# EasyEDA schematic 1-Schematic_ESC36V_2.0.json

## Sheets
1 Procesor: TITLE: Procesor; REV: 1.1; Date: 2019-11-12; Sheet: 2/6; Drawn By: Szymon Hałucha; Company: Robonomik
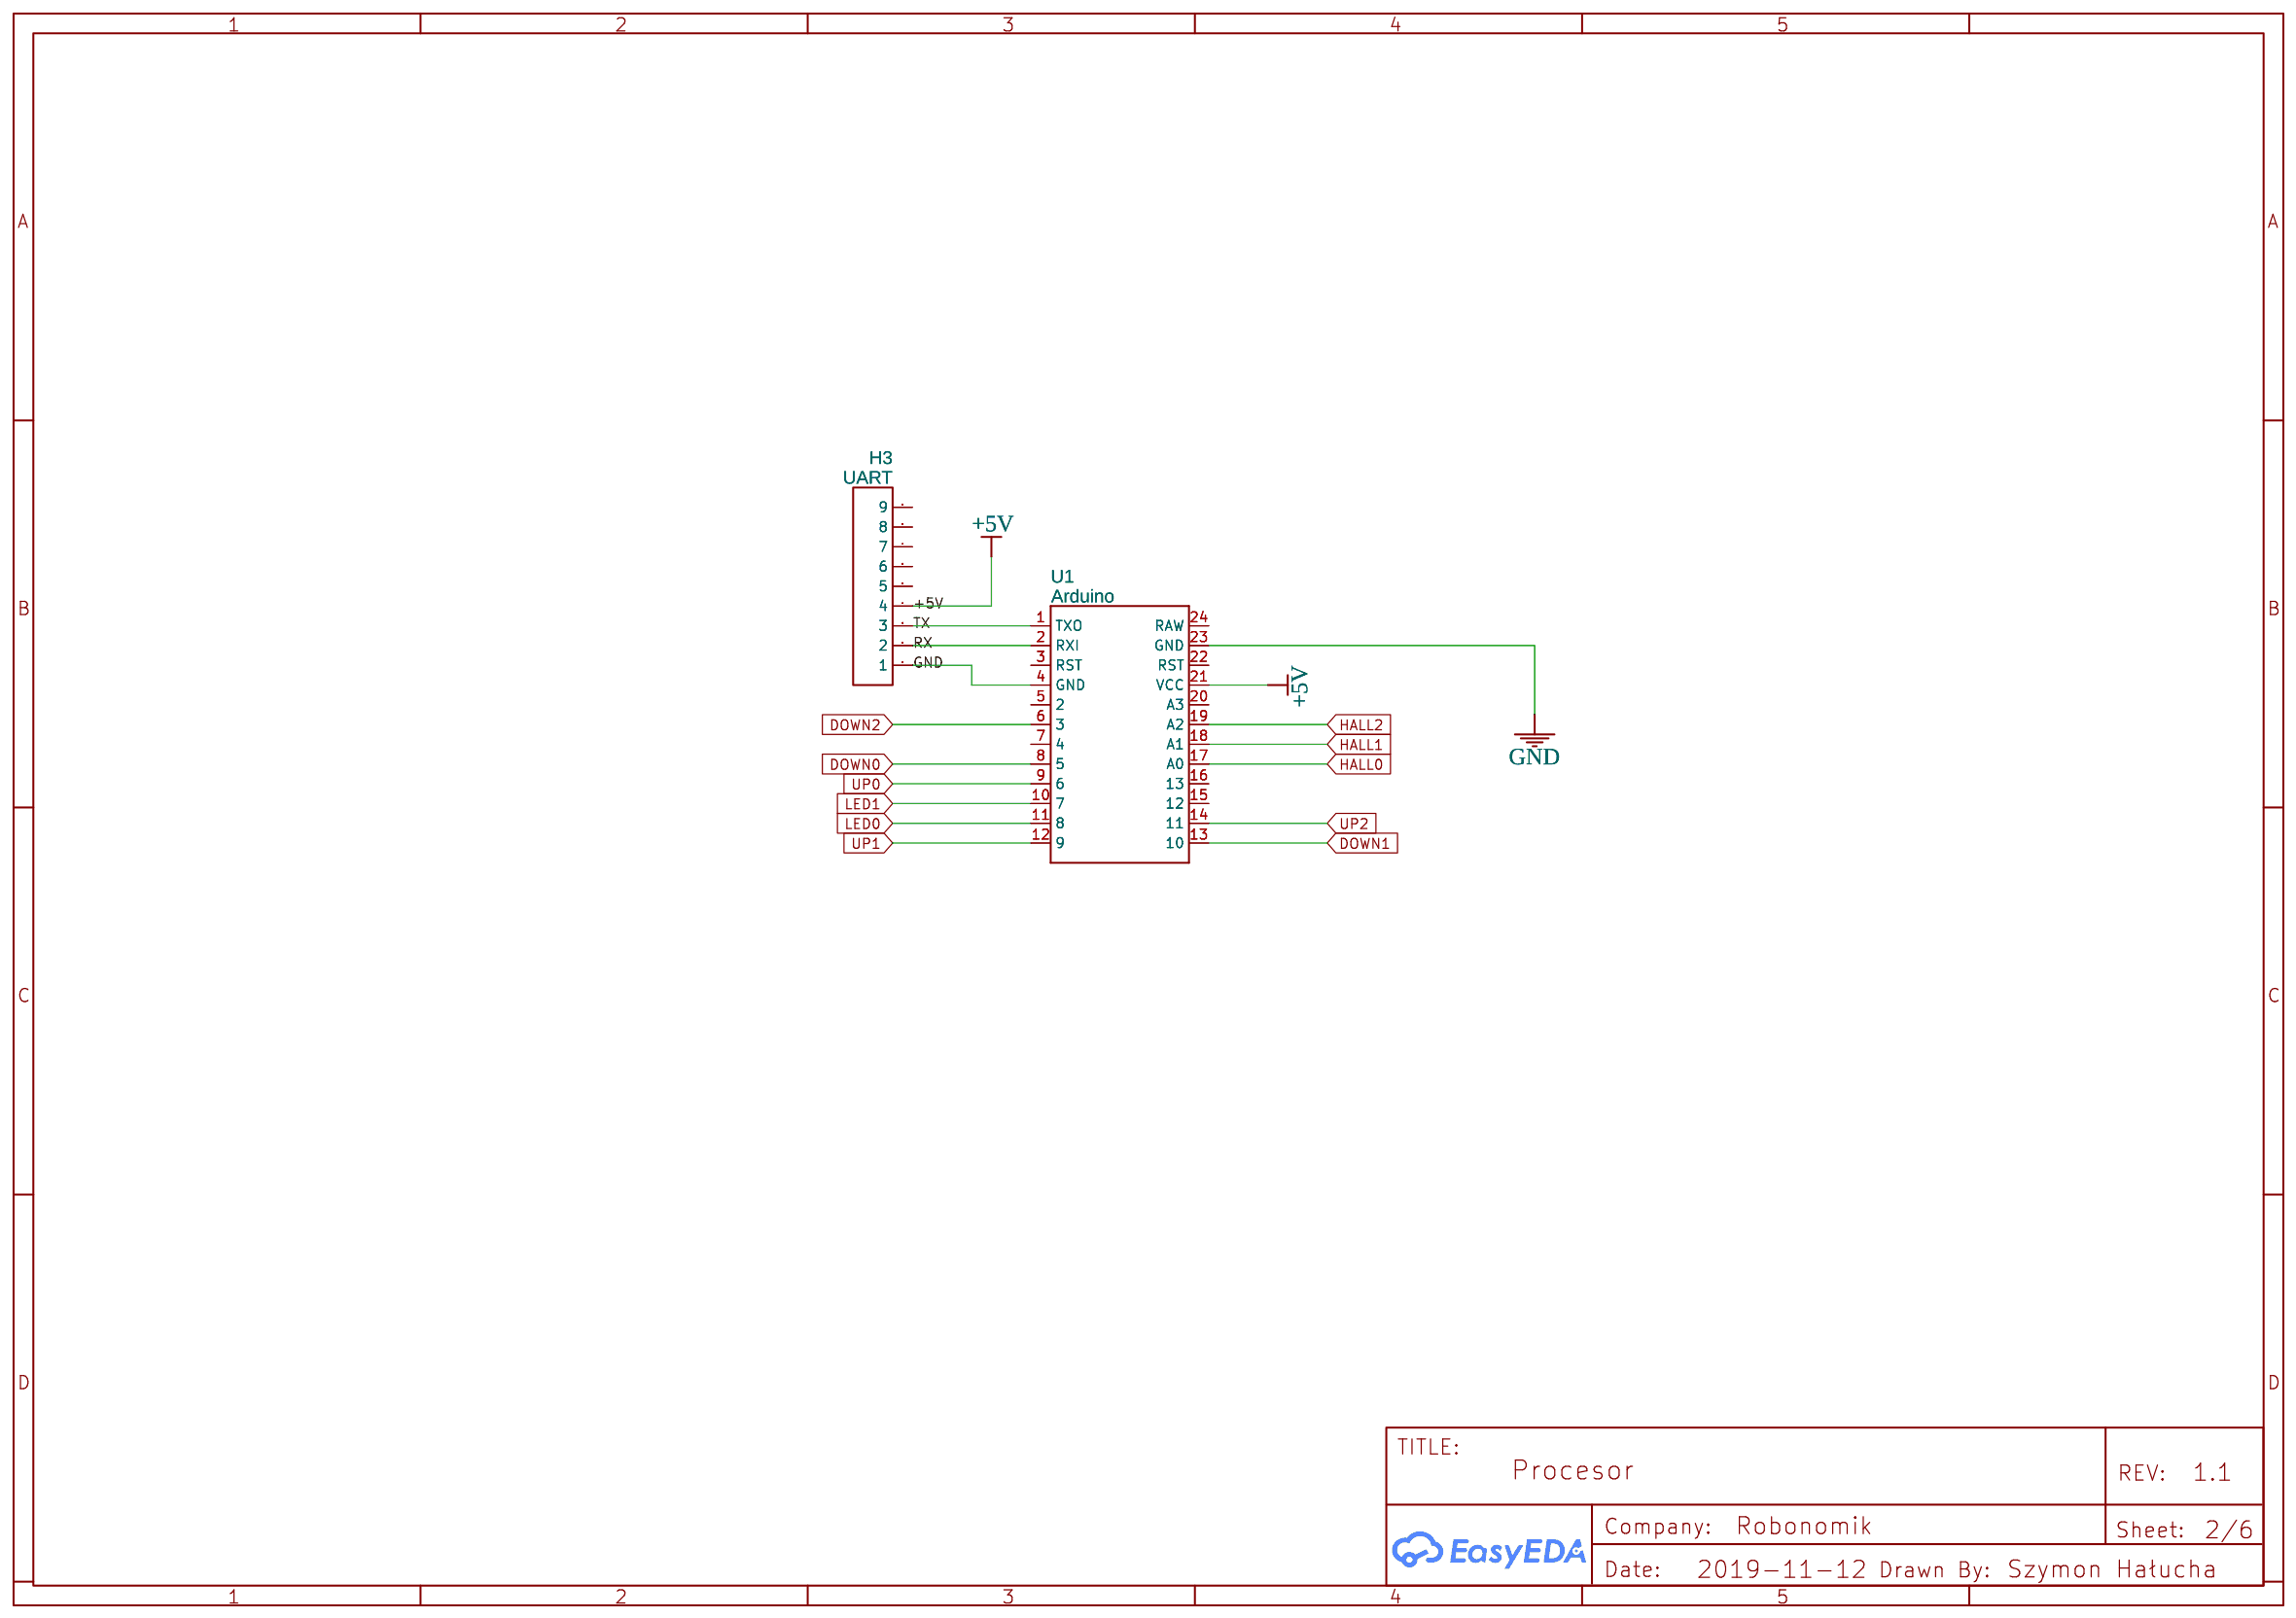
[diagram p0: Procesor]
2 Zasilanie: TITLE: Zasilanie; Date: 2019-11-13; Sheet: 1/6
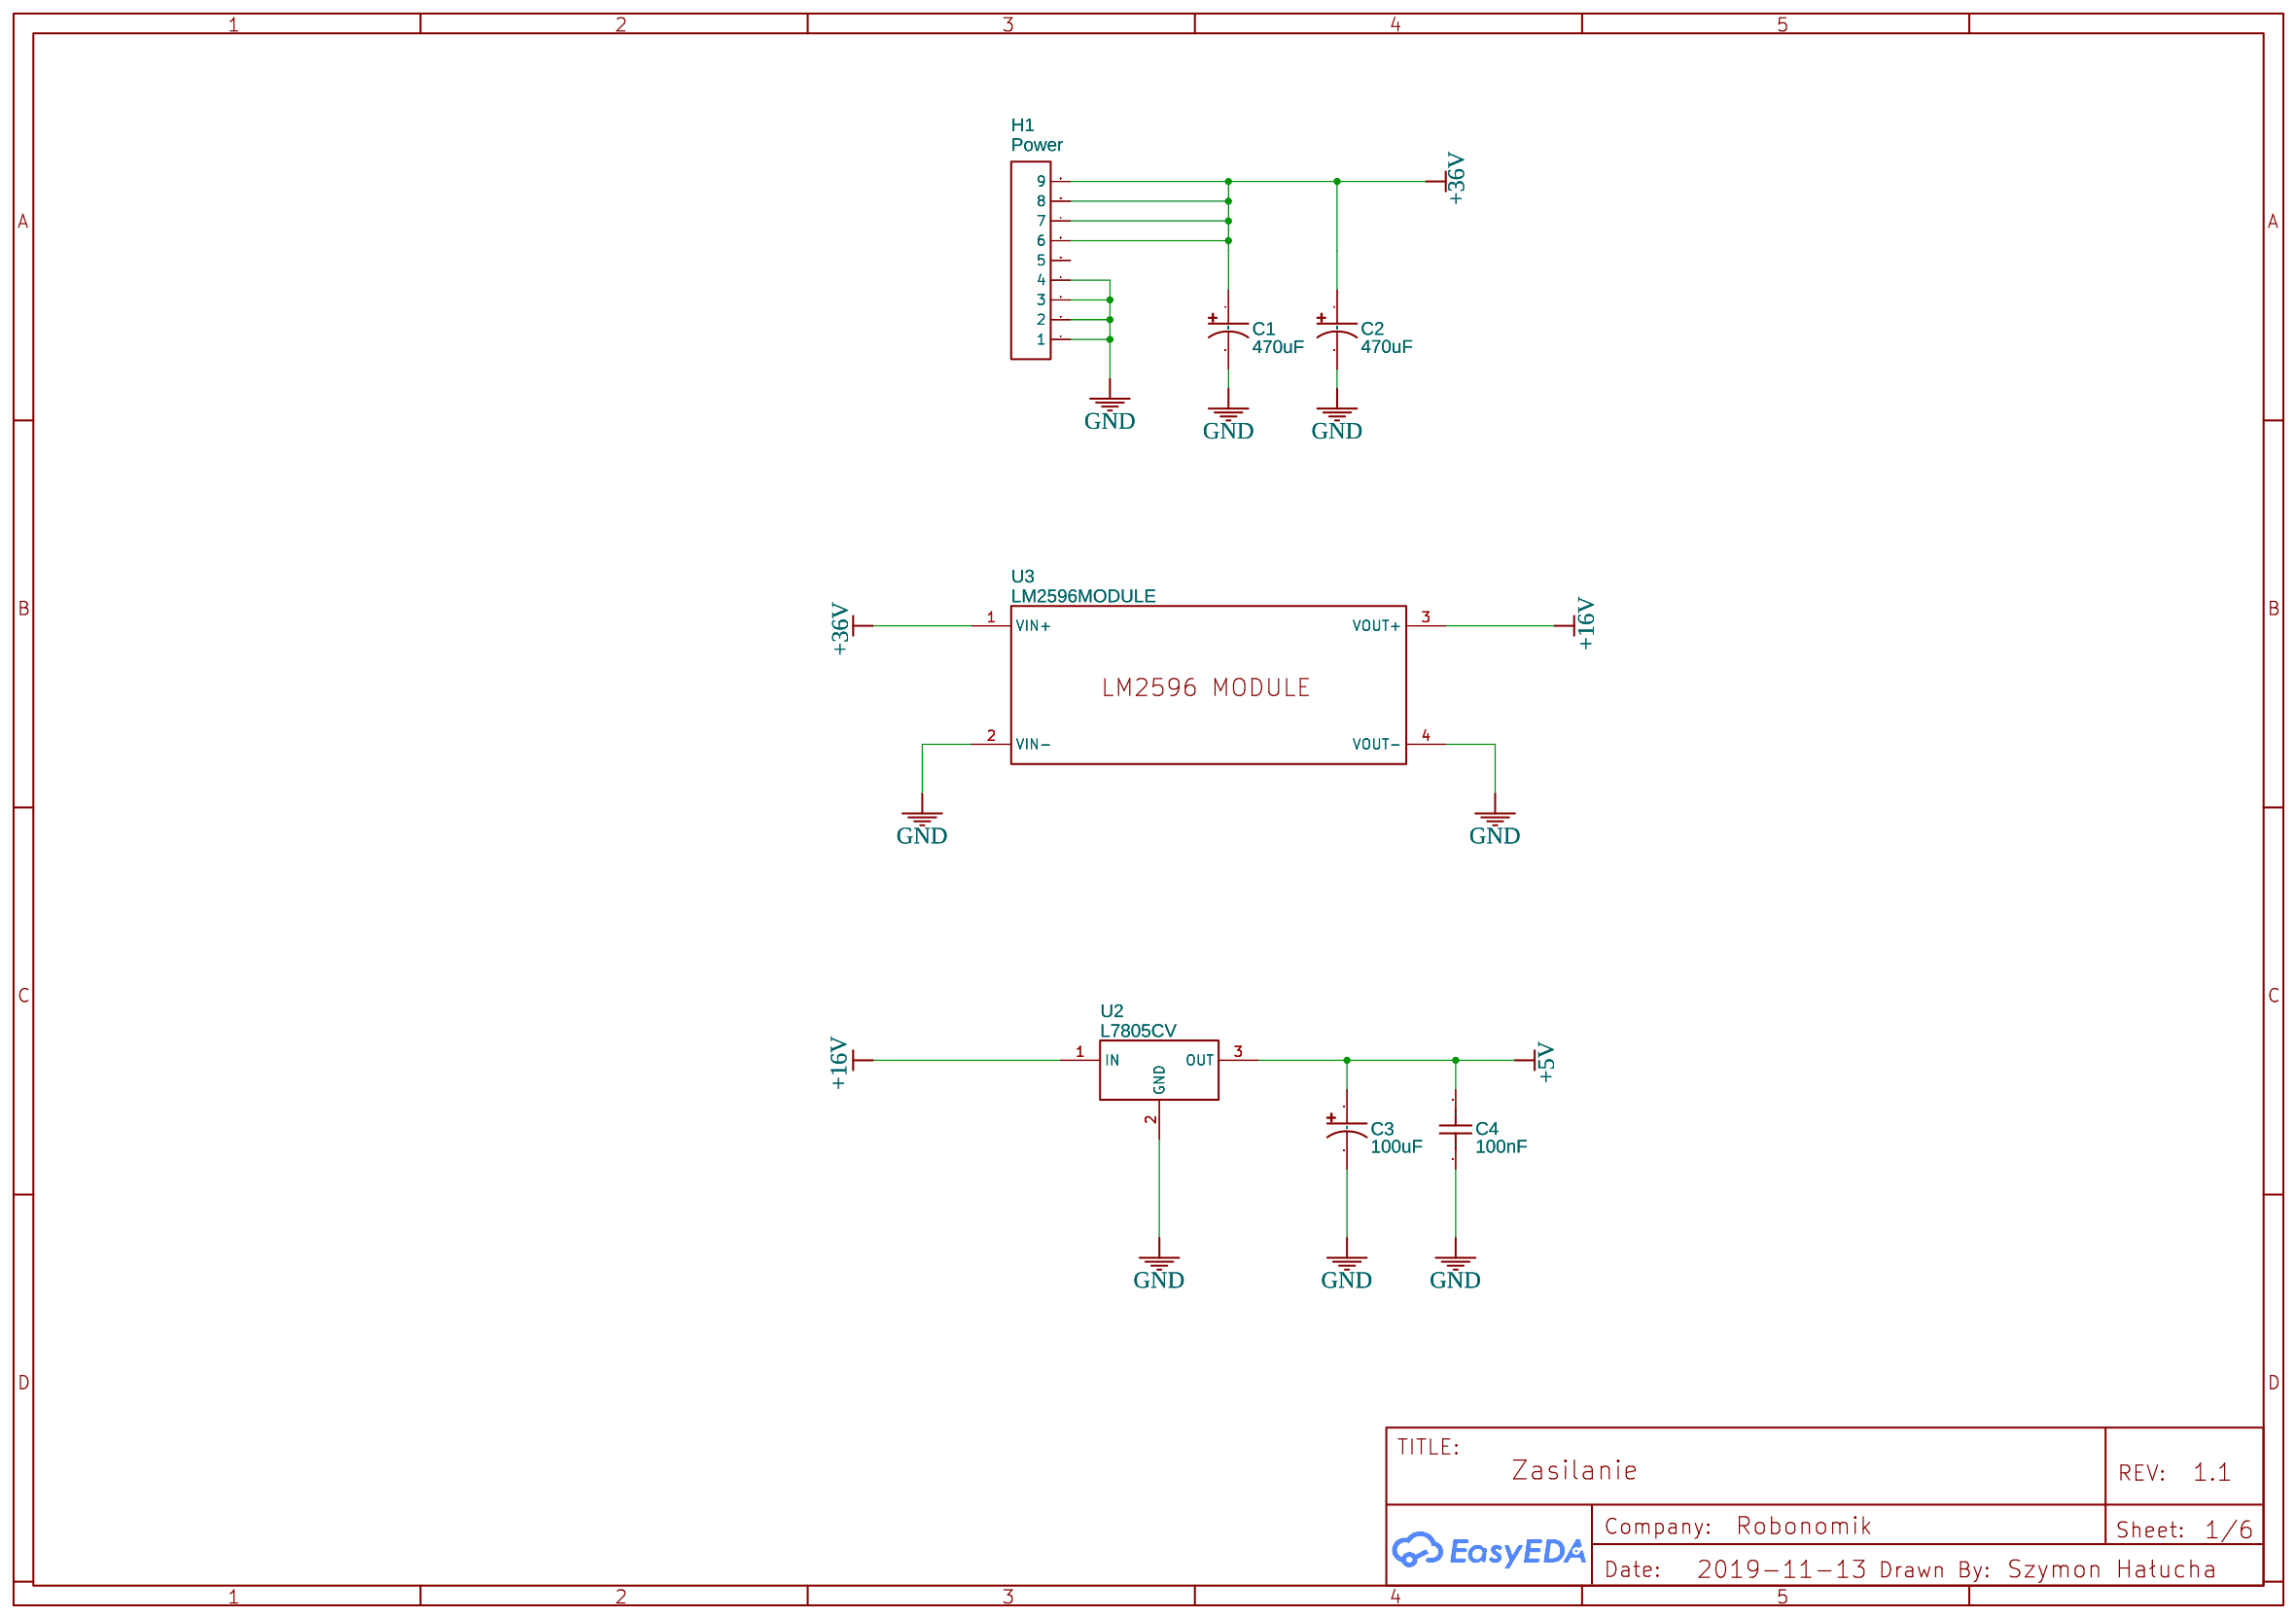
[diagram p1: Zasilanie]
3 TransA: TITLE: Tranzystory - faza A; Date: 2019-11-13; Sheet: 3/6
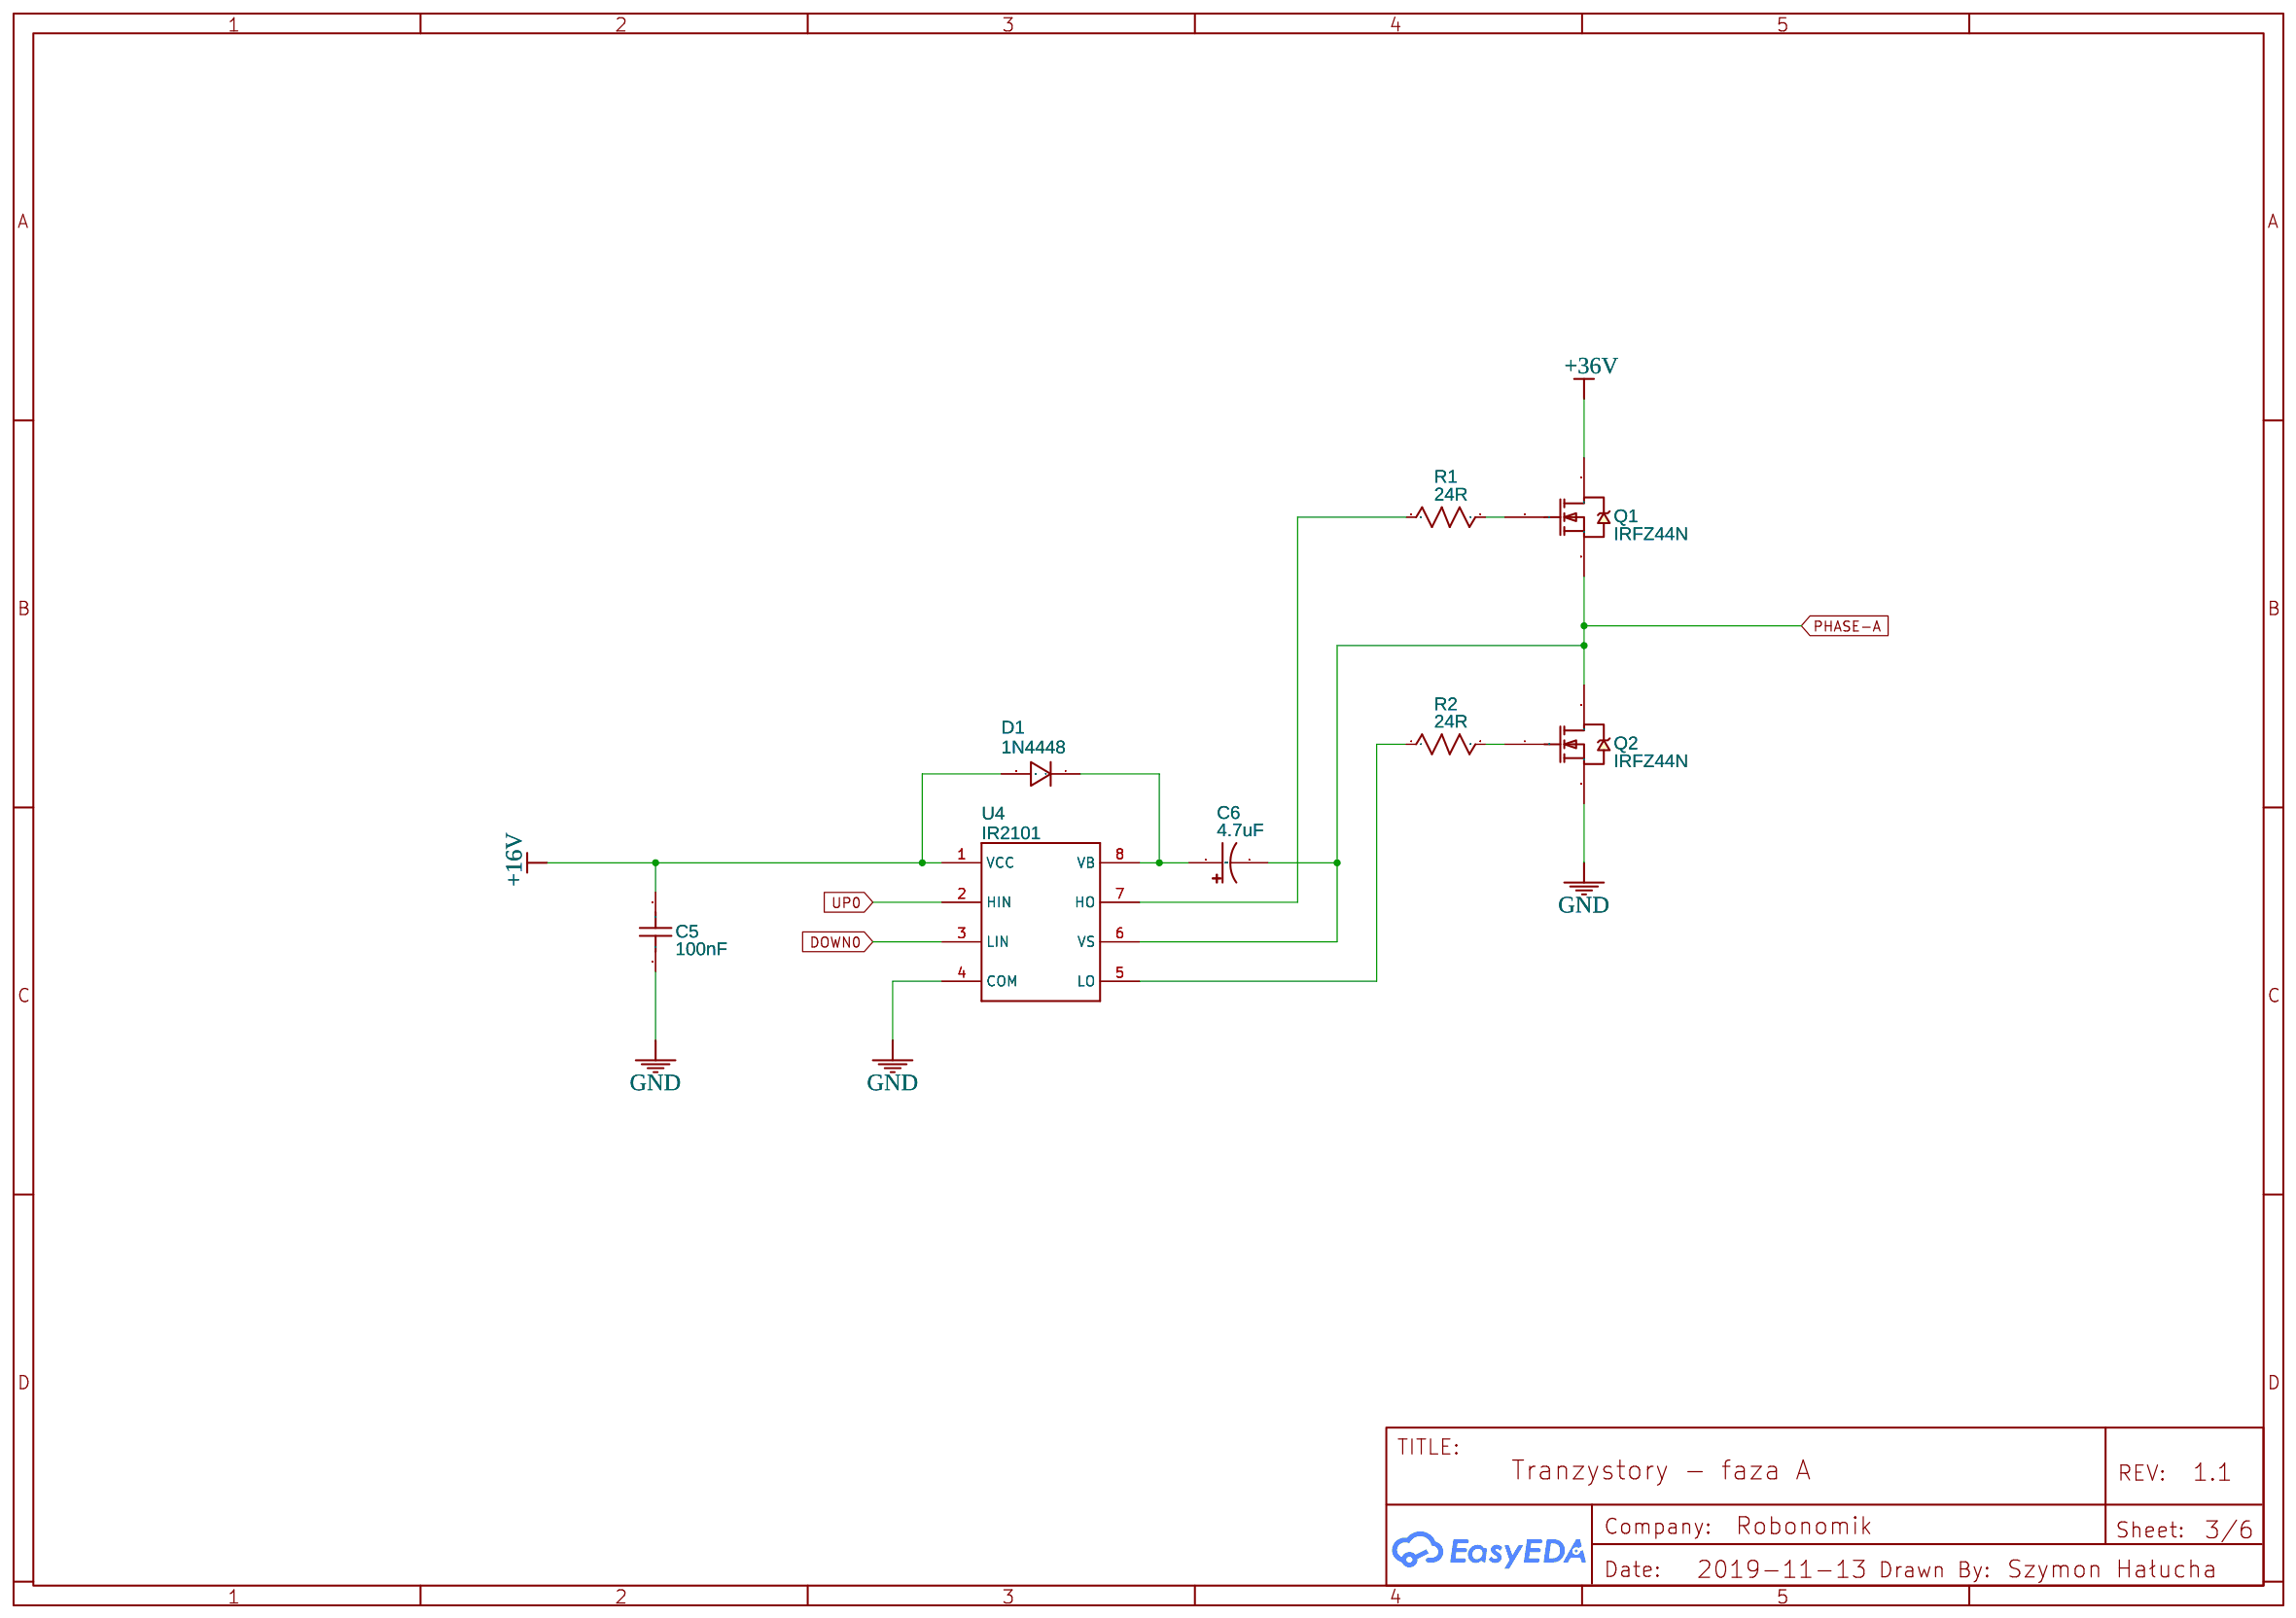
[diagram p2: TransA]
4 TransB: TITLE: Tranzystory - faza B; Date: 2019-11-13; Sheet: 4/6
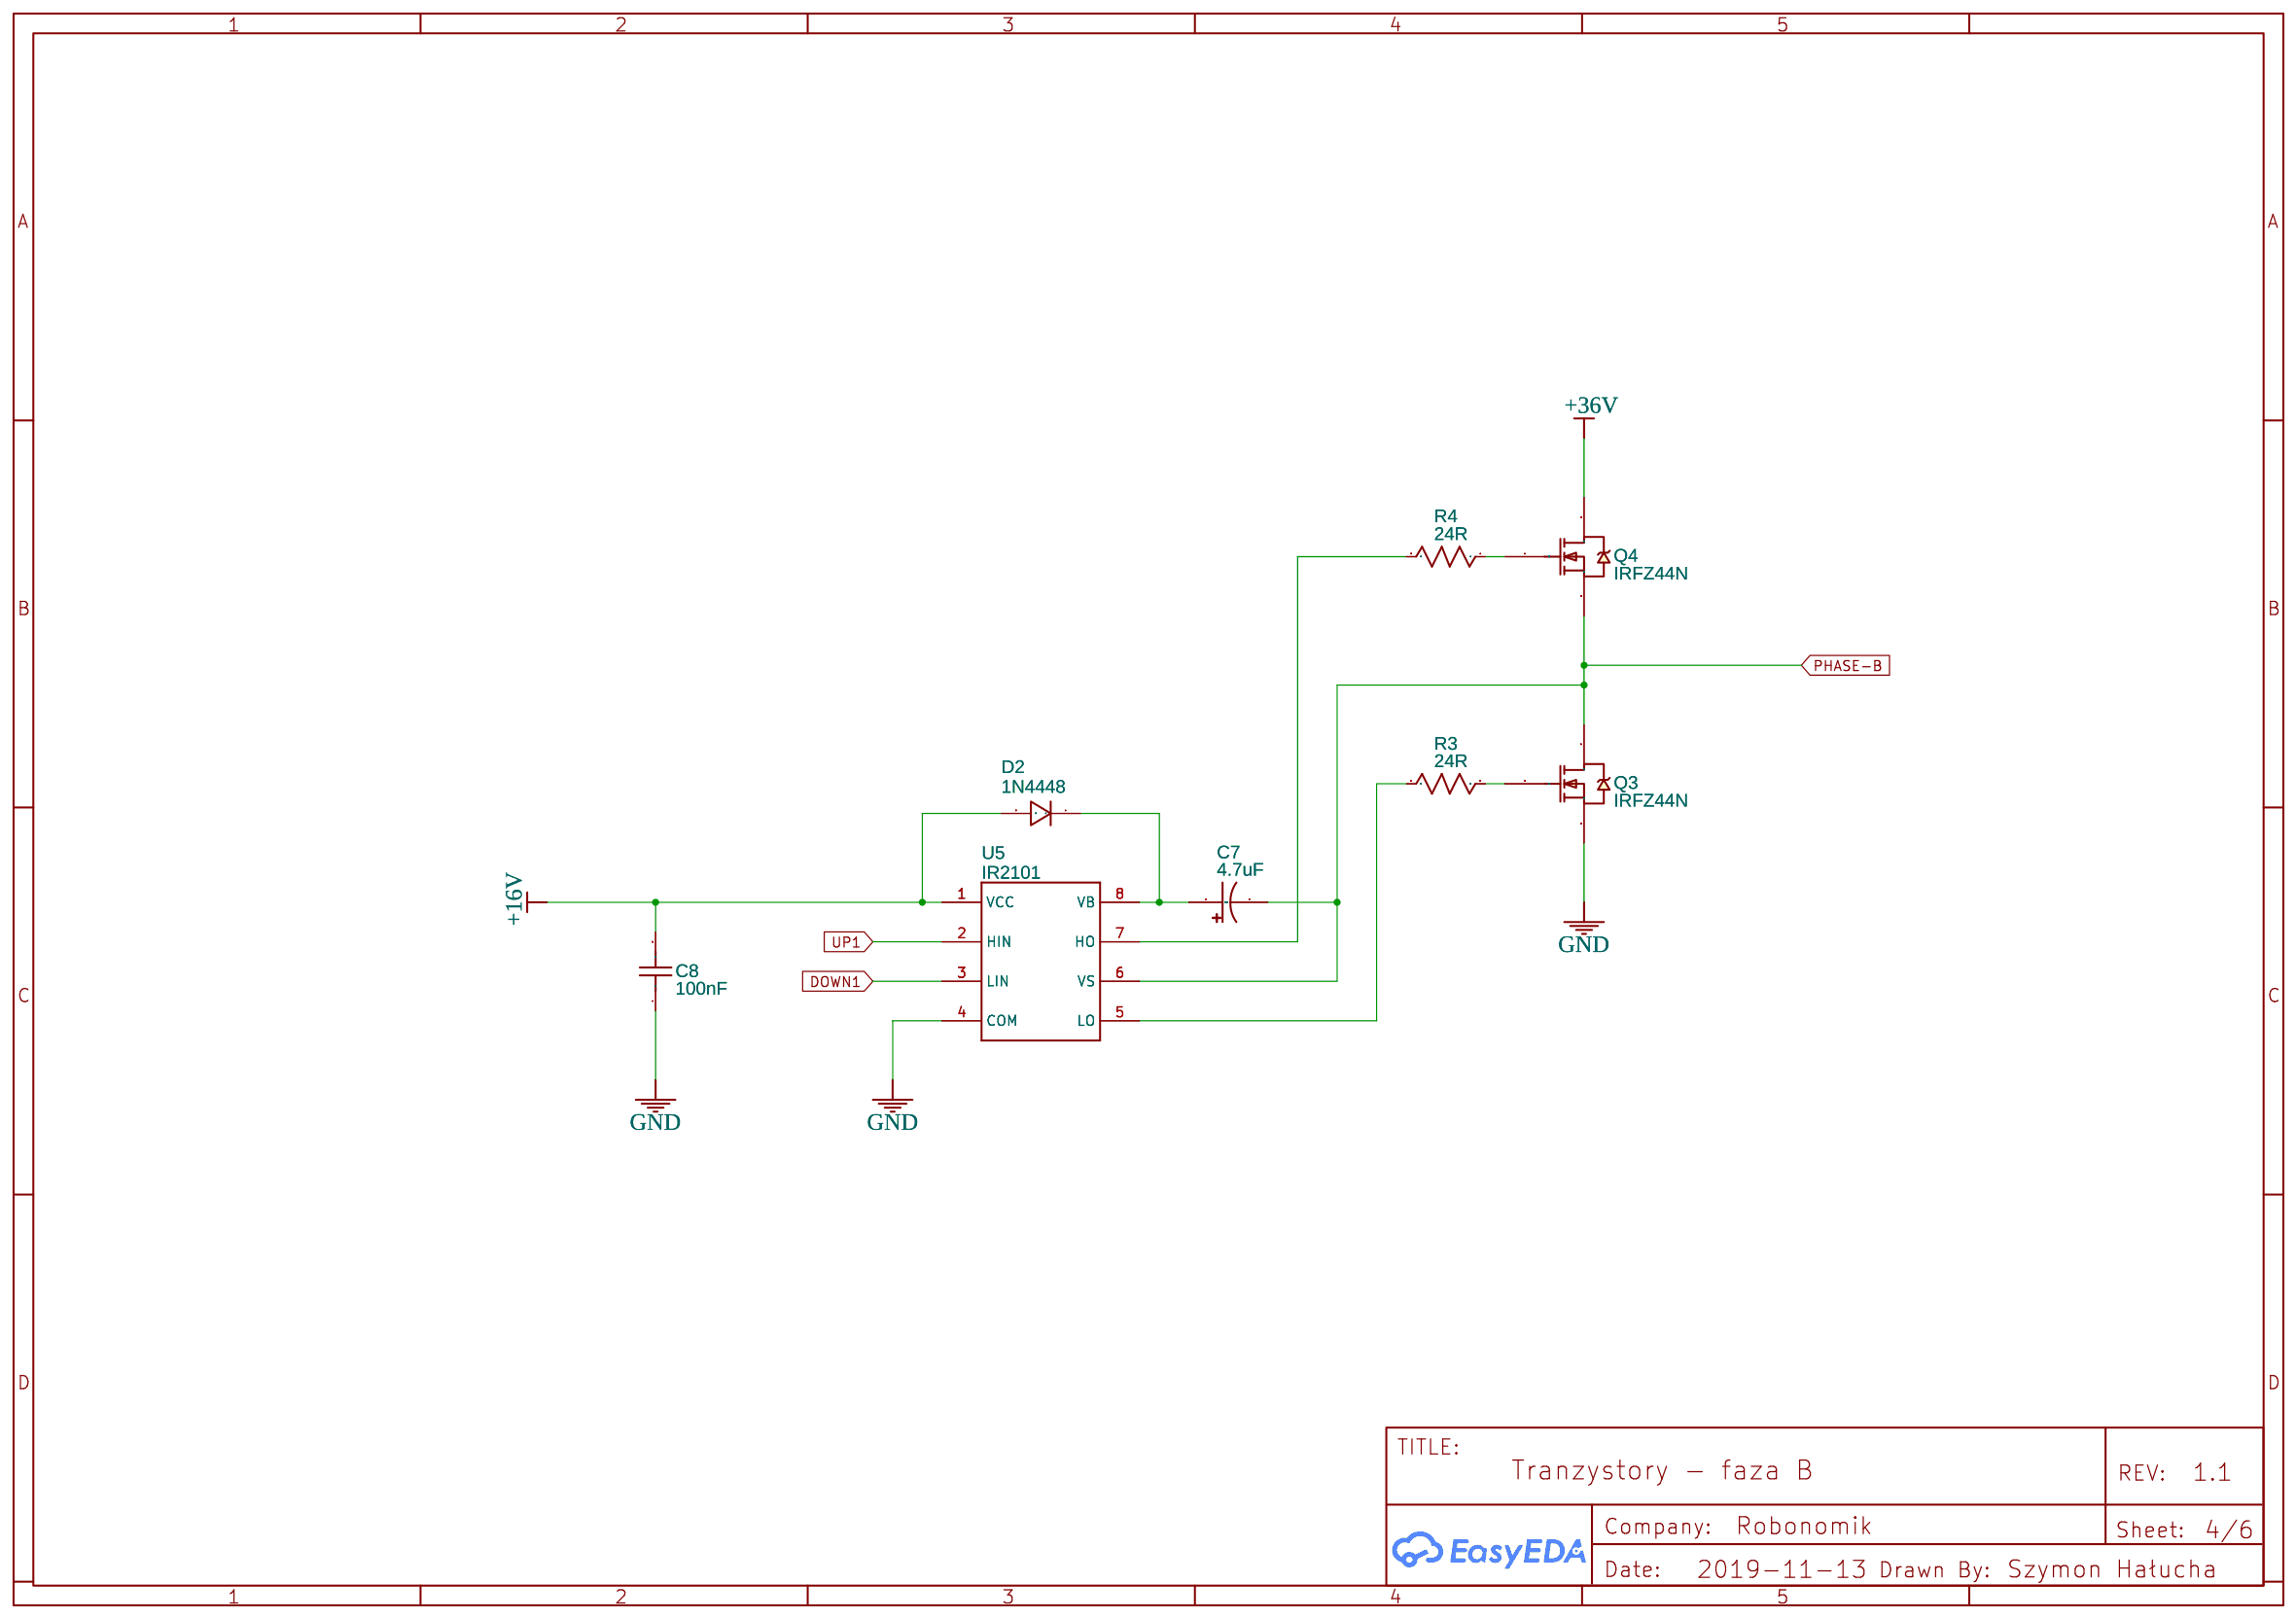
[diagram p3: TransB]
5 TransC: TITLE: Tranzystory - faza C; Date: 2019-11-13; Sheet: 5/6
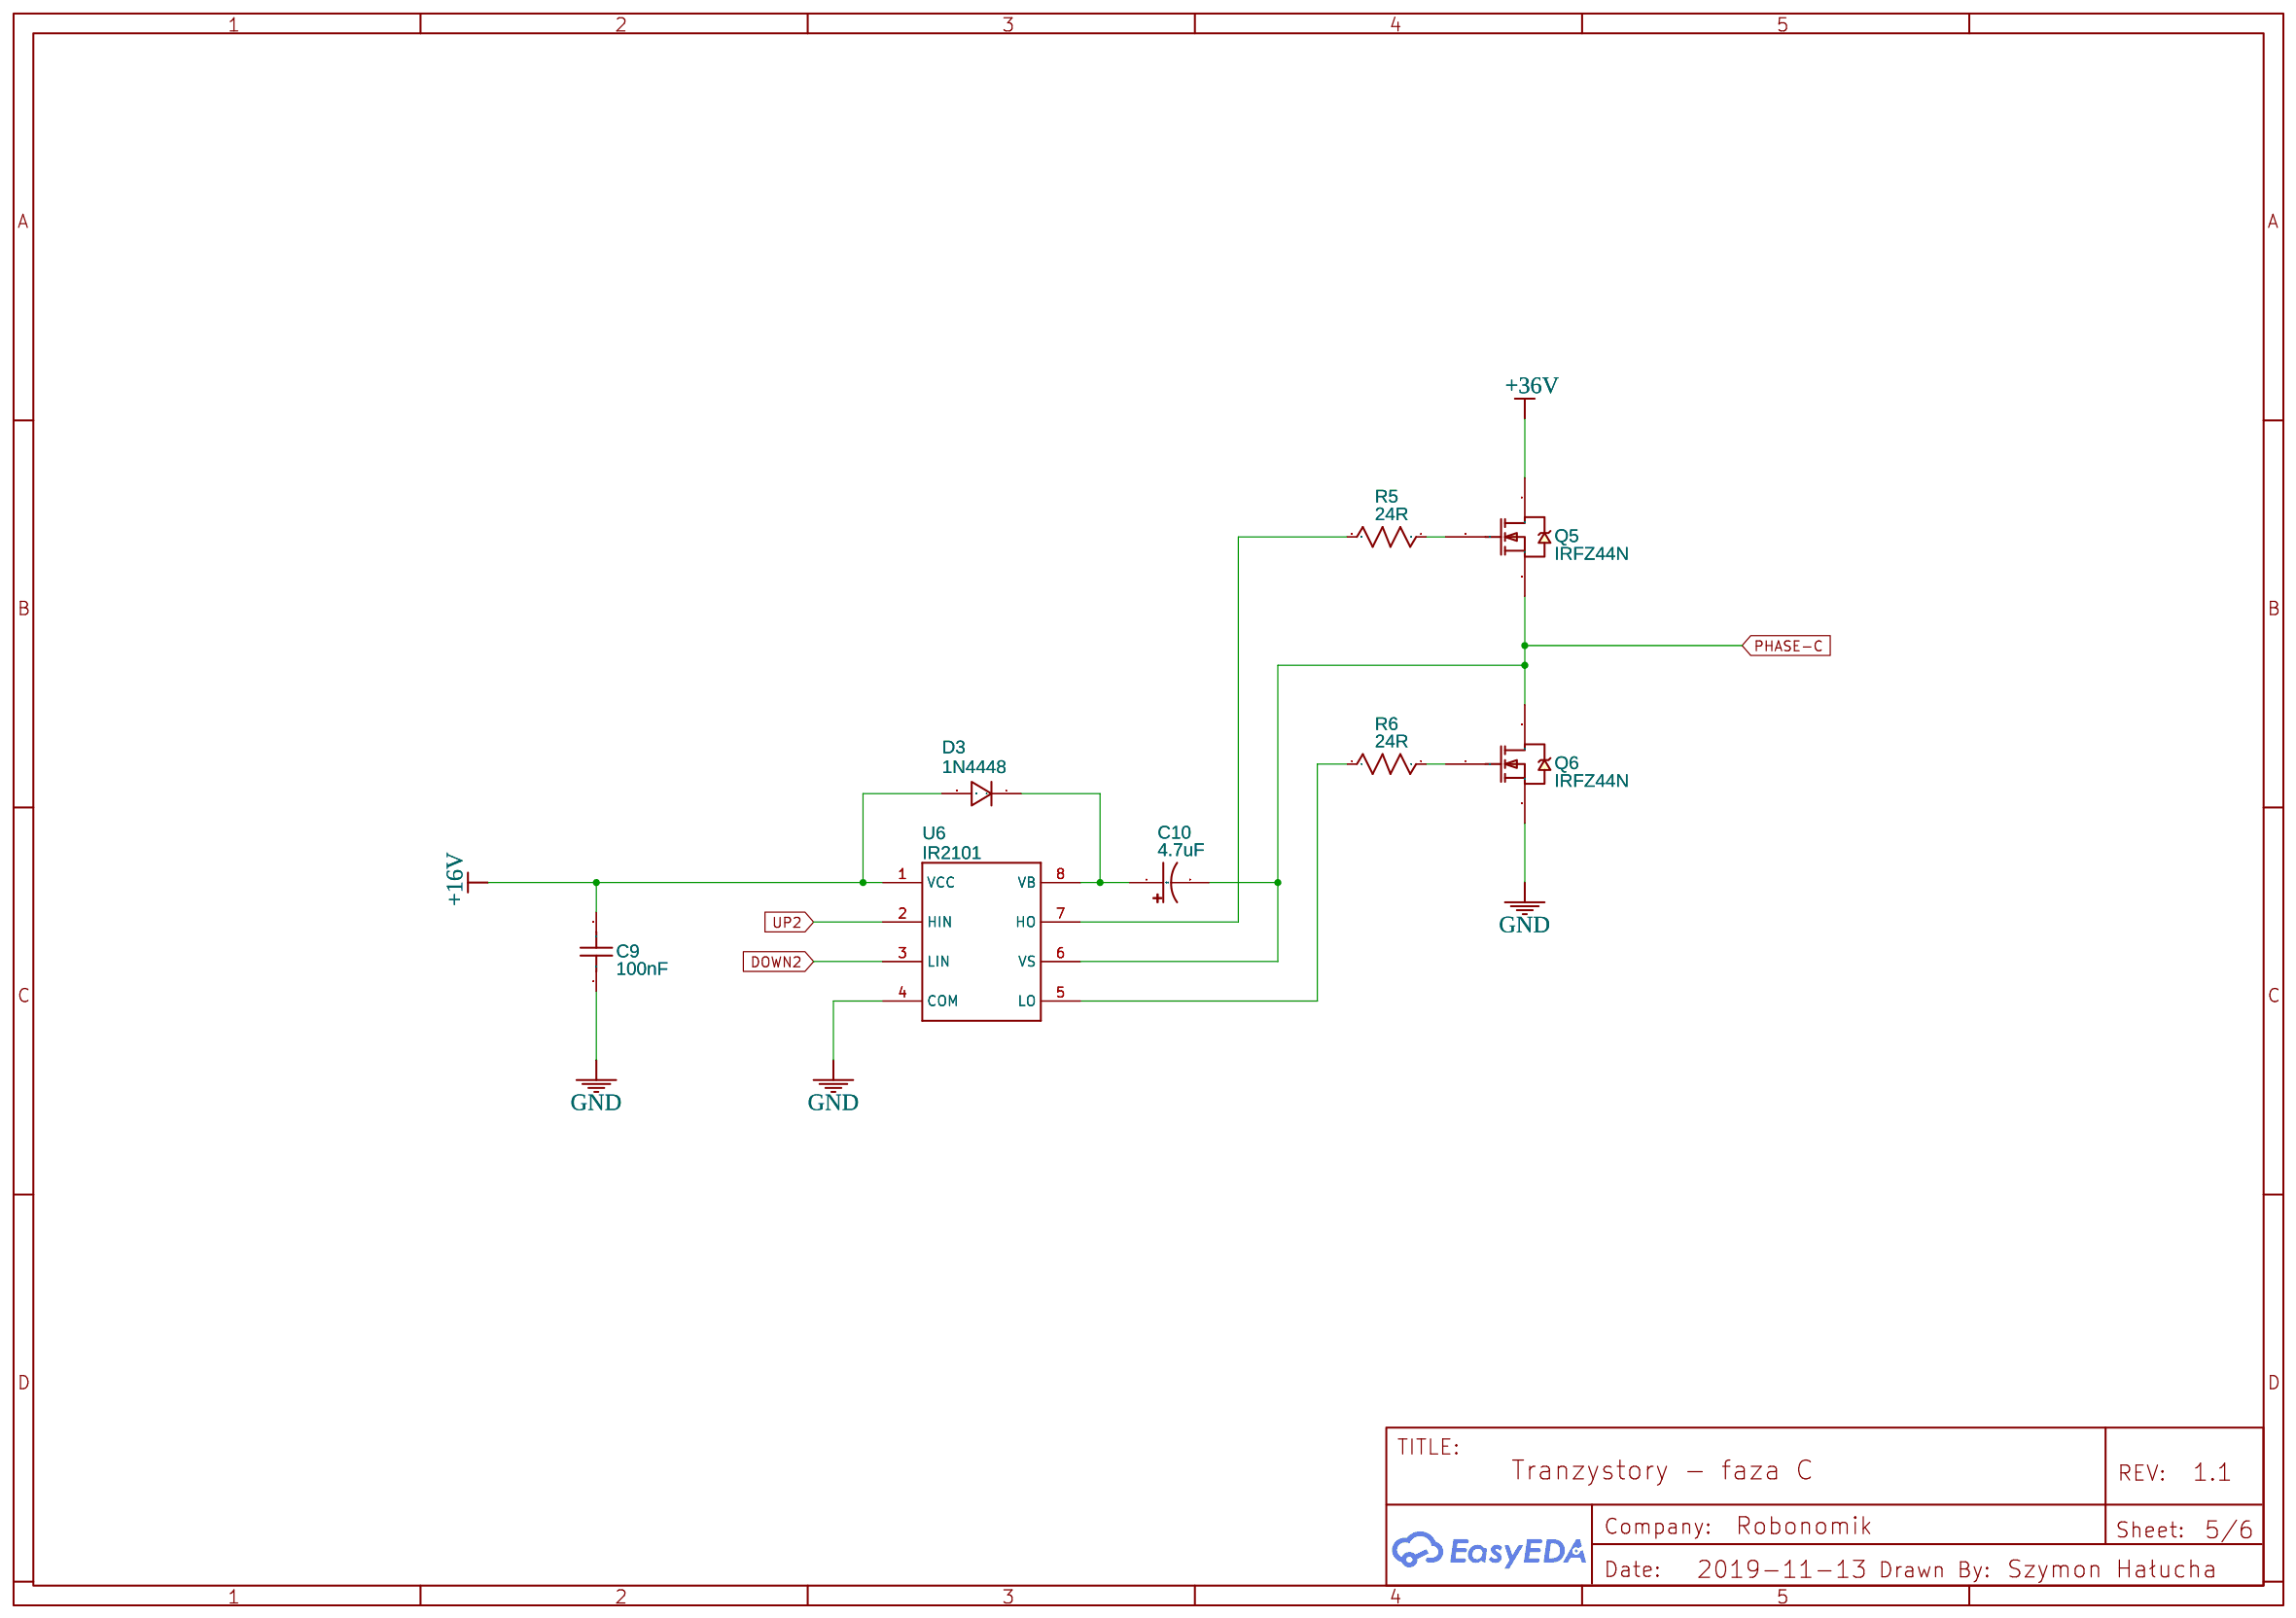
[diagram p4: TransC]
6 Silnik: TITLE: Podłączenie faz; Date: 2019-11-13; Sheet: 6/6
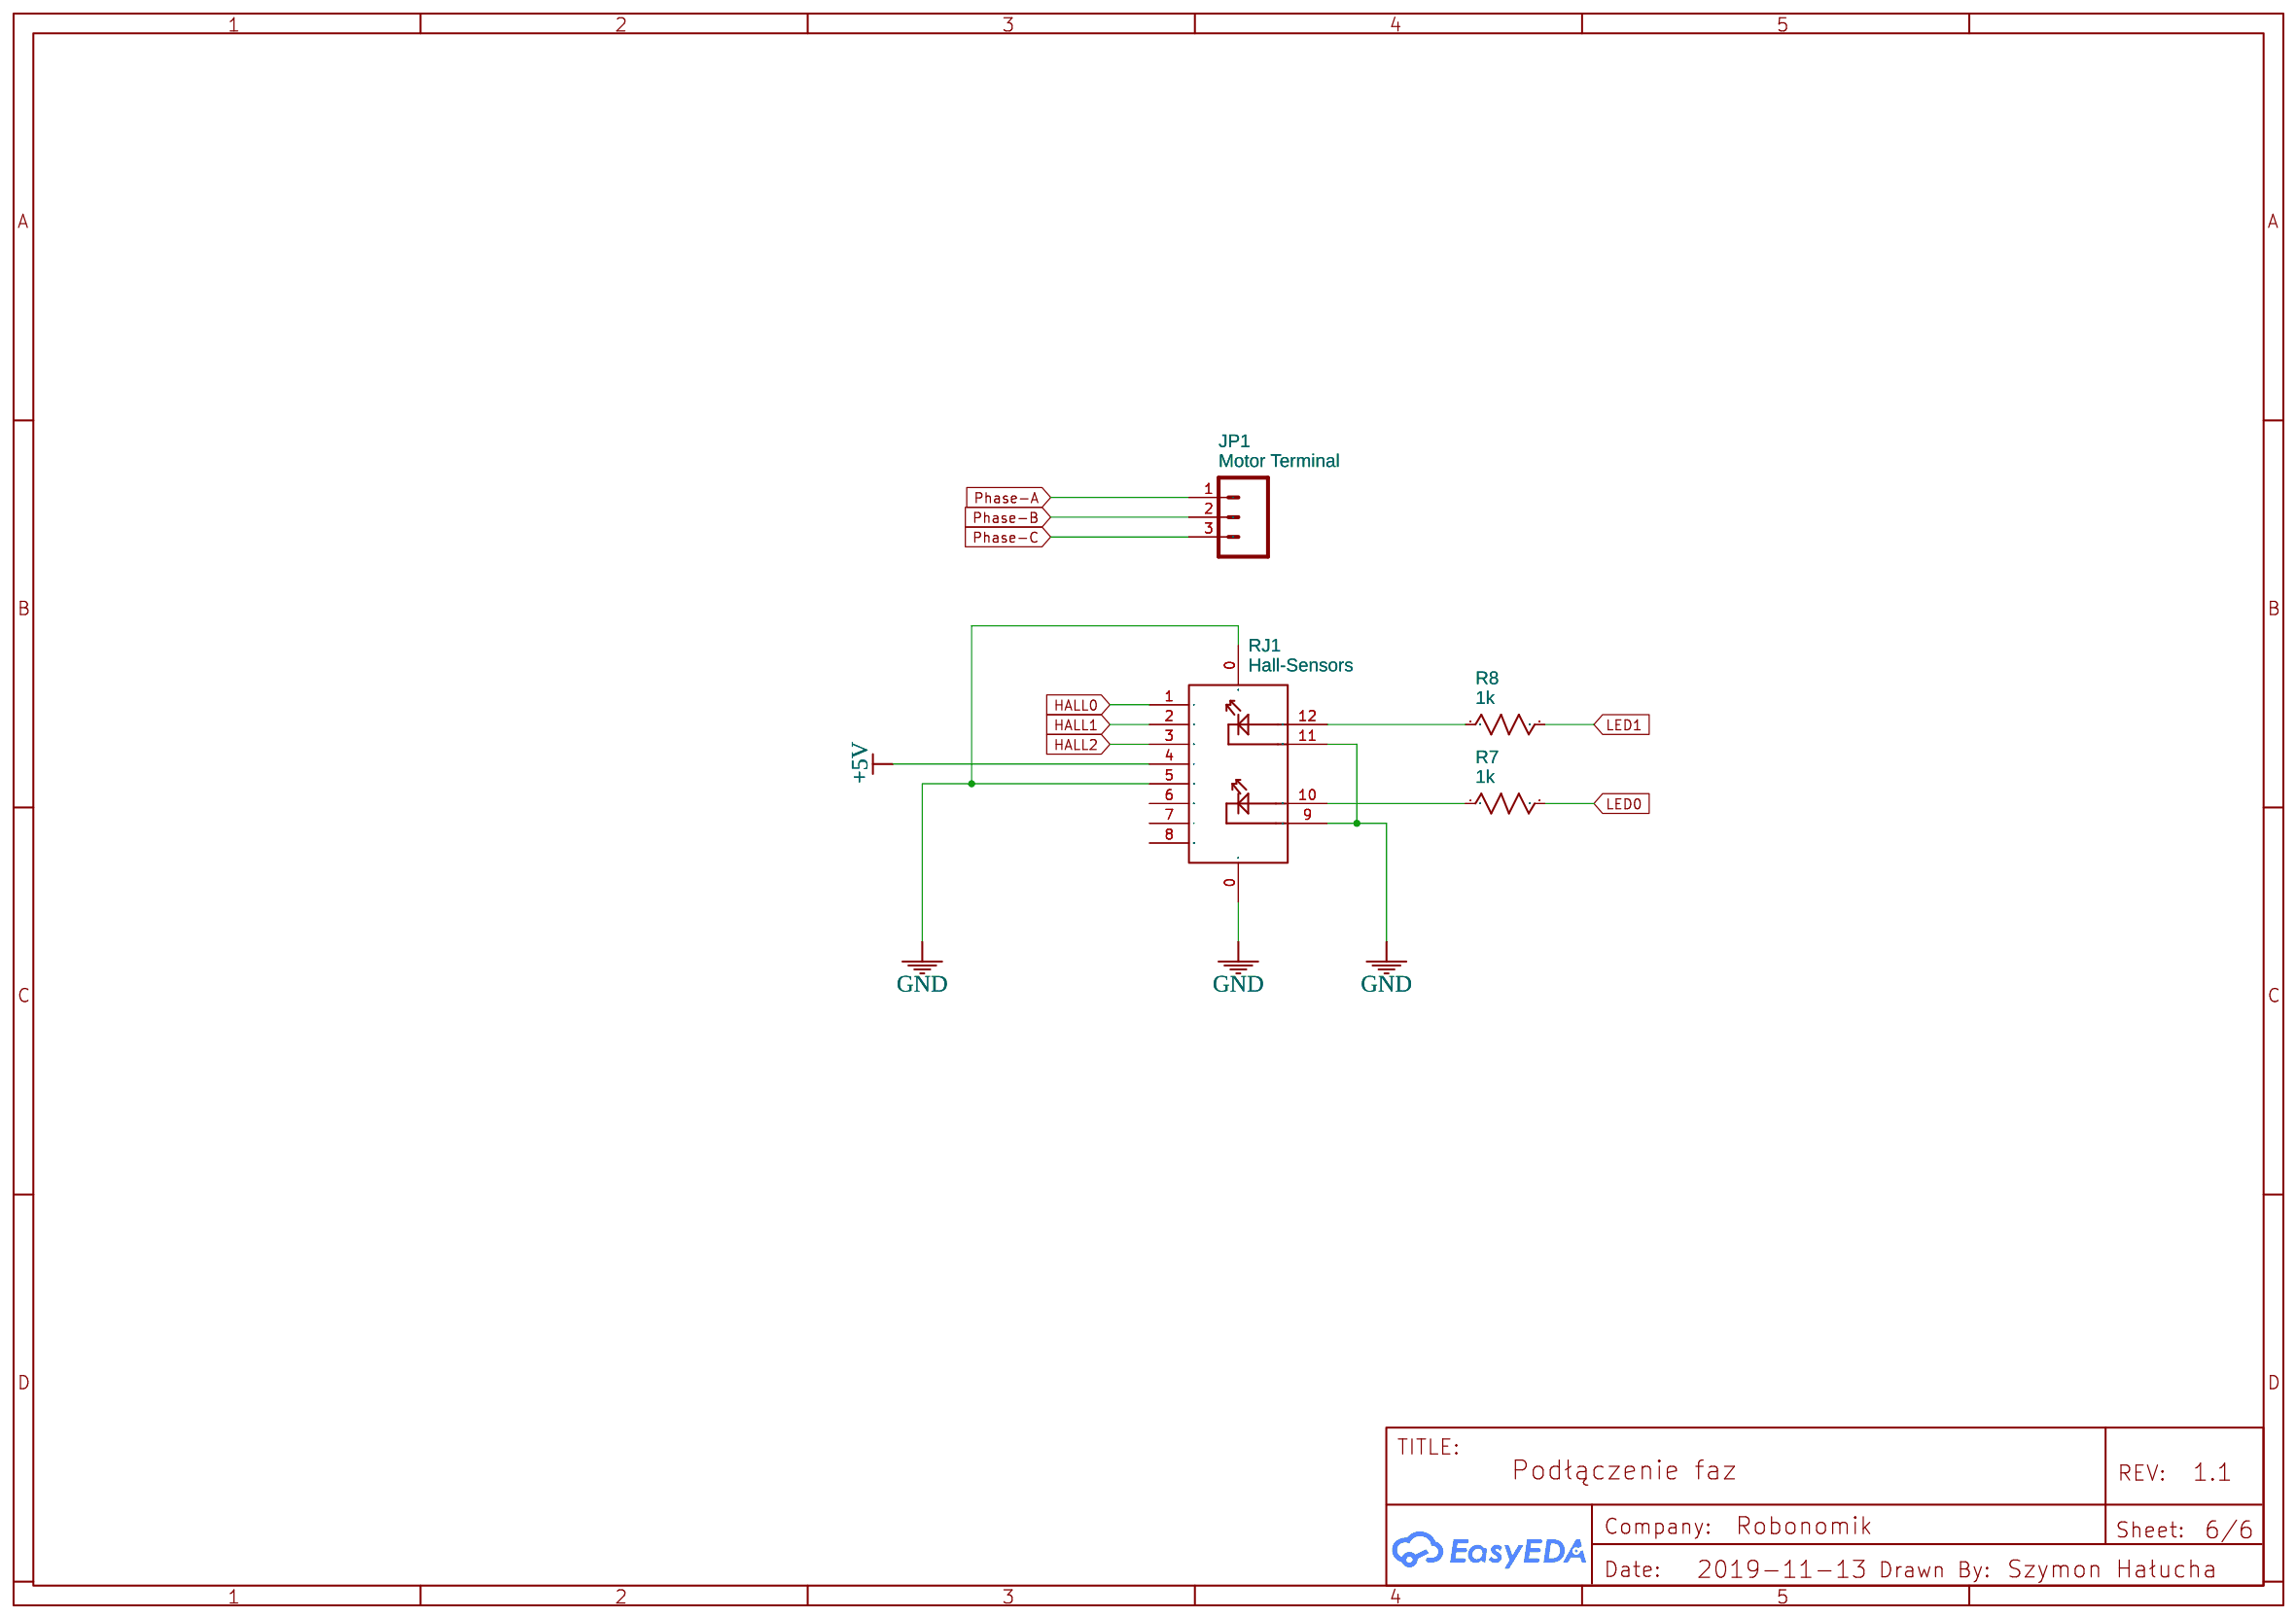
[diagram p5: Silnik]

## Parts
sheet Procesor
H3  UART  [HDR-TH_9P-P2.54-V]
U1  Arduino  [ARDUINO_MINI]
sheet Silnik
JP1  Motor Terminal  [SCREWTERMINAL-5MM-3]
R7  1k  [AXIAL-0.4]
R8  1k  [AXIAL-0.4]
RJ1  Hall-Sensors  [RJ45-B-1*1]
sheet TransA
C5  100nF  [RAD-0.1]
C6  4.7uF  [CAP-D5.0XF2.0]
D1  1N4448  [DO-35_BD2.0-L4.2-P8.20-D0.5-RD]
Q1  IRFZ44N  [TO-220AB]
Q2  IRFZ44N  [TO-220AB]
R1  24R  [AXIAL-0.4]
R2  24R  [AXIAL-0.4]
U4  IR2101  [DIP8]
sheet TransB
C7  4.7uF  [CAP-D5.0XF2.0]
C8  100nF  [RAD-0.1]
D2  1N4448  [DO-35_BD2.0-L4.2-P8.20-D0.5-RD]
Q3  IRFZ44N  [TO-220AB]
Q4  IRFZ44N  [TO-220AB]
R3  24R  [AXIAL-0.4]
R4  24R  [AXIAL-0.4]
U5  IR2101  [DIP8]
sheet TransC
C9  100nF  [RAD-0.1]
C10  4.7uF  [CAP-D5.0XF2.0]
D3  1N4448  [DO-35_BD2.0-L4.2-P8.20-D0.5-RD]
Q5  IRFZ44N  [TO-220AB]
Q6  IRFZ44N  [TO-220AB]
R5  24R  [AXIAL-0.4]
R6  24R  [AXIAL-0.4]
U6  IR2101  [DIP8]
sheet Zasilanie
C1  470uF  [CAP-D12.5XF5.0]
C2  470uF  [CAP-D12.5XF5.0]
C3  100uF  [CAP-D5.0XF2.0]
C4  100nF  [RAD-0.1]
H1  Power  [HDR-TH_9P-P2.54-V]
U2  L7805CV  [TO-220-3_L10.0-W4.5-P2.54-L]
U3  LM2596MODULE  [LM2596-MODULE]

## Library data of the parts
H1 H3 = -: Supplier: LCSC; Manufacturer: BOOMELE; Manufacturer Part: 2.54mm 1*9 Straight Female header; image: //image.lceda.cn/szlcsc/C39576.jpg; Supplier Part: C39576
U1 = -: Arduino Pro Mini footprint; Contributor: SparkFun
JP1 = -: Header 3; Contributor: SparkFun
R1-R8 = Res_AXIAL-0.4(1/4W)_US
RJ1 = -: Supplier: LCSC; Manufacturer: BOOMELE; Contributor: LCSC; Supplier Part: C138392
C4 C5 C8 C9 = Cap_RAD-0.1_US
C3 C6 C7 C10 = Cap_Electrolytic(TH)_D5.0XF2.0_US
D1-D3 = -: Supplier: LCSC; Supplier Part: C258170; Manufacturer: ON Semicon; Contributor: LCSC
Q1-Q6 = -: HEXFET Power MOSFET
C1 C2 = Cap_Electrolytic(TH)_D12.5XF5.0_US
U2 = -: Supplier: LCSC; Manufacturer: STMicroelectronics; Supplier Part: C111887
U3 = -: Contributor: Admech

## Nets
+5V: C3.1 C4.2 H3.4 RJ1.4 U1.21(VCC) U2.3(OUT)
+16V: C5.2 C8.2 C9.2 D1.2 D2.2 D3.2 U2.1(IN) U3.3(VOUT+) U4.1(VCC) U5.1(VCC) U6.1(VCC)
+36V: C1.1 C2.1 H1.6 H1.7 H1.8 H1.9 Q1.2(D) Q4.2(D) Q5.2(D) U3.1(VIN+)
GND: C1.2 C2.2 C3.2 C4.1 C5.1 C8.1 C9.1 H1.1 H1.2 H1.3 H1.4 H3.1 Q2.3(S) Q3.3(S) Q6.3(S) RJ1.0(S) RJ1.5 RJ1.9 RJ1.11 U1.4(GND) U1.23(GND) U2.2(GND) U3.2(VIN-) U3.4(VOUT-) U4.4(COM) U5.4(COM) U6.4(COM)
DOWN0: U1.8(5) U4.3(LIN)
DOWN1: U1.13(10) U5.3(LIN)
DOWN2: U1.6(3) U6.3(LIN)
HALL0: RJ1.1 U1.17(A0)
HALL1: RJ1.2 U1.18(A1)
HALL2: RJ1.3 U1.19(A2)
LED0: R7.2 U1.11(8)
LED1: R8.2 U1.10(7)
PHASE-A: C6.2 Q1.3(S) Q2.2(D) U4.6(VS)
Phase-A: JP1.1
PHASE-B: C7.2 Q3.2(D) Q4.3(S) U5.6(VS)
Phase-B: JP1.2
PHASE-C: C10.2 Q5.3(S) Q6.2(D) U6.6(VS)
Phase-C: JP1.3
RX: H3.2 U1.2(RXI)
TX: H3.3 U1.1(TXO)
UP0: U1.9(6) U4.2(HIN)
UP1: U1.12(9) U5.2(HIN)
UP2: U1.14(11) U6.2(HIN)
C7_1: C7.1 D2.1 U5.8(VB)
Q1_1: Q1.1(G) R1.1
Q3_1: Q3.1(G) R3.2
Q5_1: Q5.1(G) R5.1
R2_2: Q2.1(G) R2.2
R3_1: R3.1 U5.5(LO)
R4_1: Q4.1(G) R4.1
R4_2: R4.2 U5.7(HO)
R6_2: Q6.1(G) R6.2
RJ1_10: R7.1 RJ1.10
RJ1_12: R8.1 RJ1.12
U4_5: R2.1 U4.5(LO)
U4_7: R1.2 U4.7(HO)
U4_8: C6.1 D1.1 U4.8(VB)
U6_5: R6.1 U6.5(LO)
U6_7: R5.2 U6.7(HO)
U6_8: C10.1 D3.1 U6.8(VB)

Not connected (* = marked no-connect by the designer): H1 5; H3 5 6 7 8 9; RJ1 6 7 8; U1 3(RST) 5(2) 7(4) 15(12) 16(13) 20(A3) 22(RST) 24(RAW)
